# EAGLE design untitled (EAGLE 6.5.0)
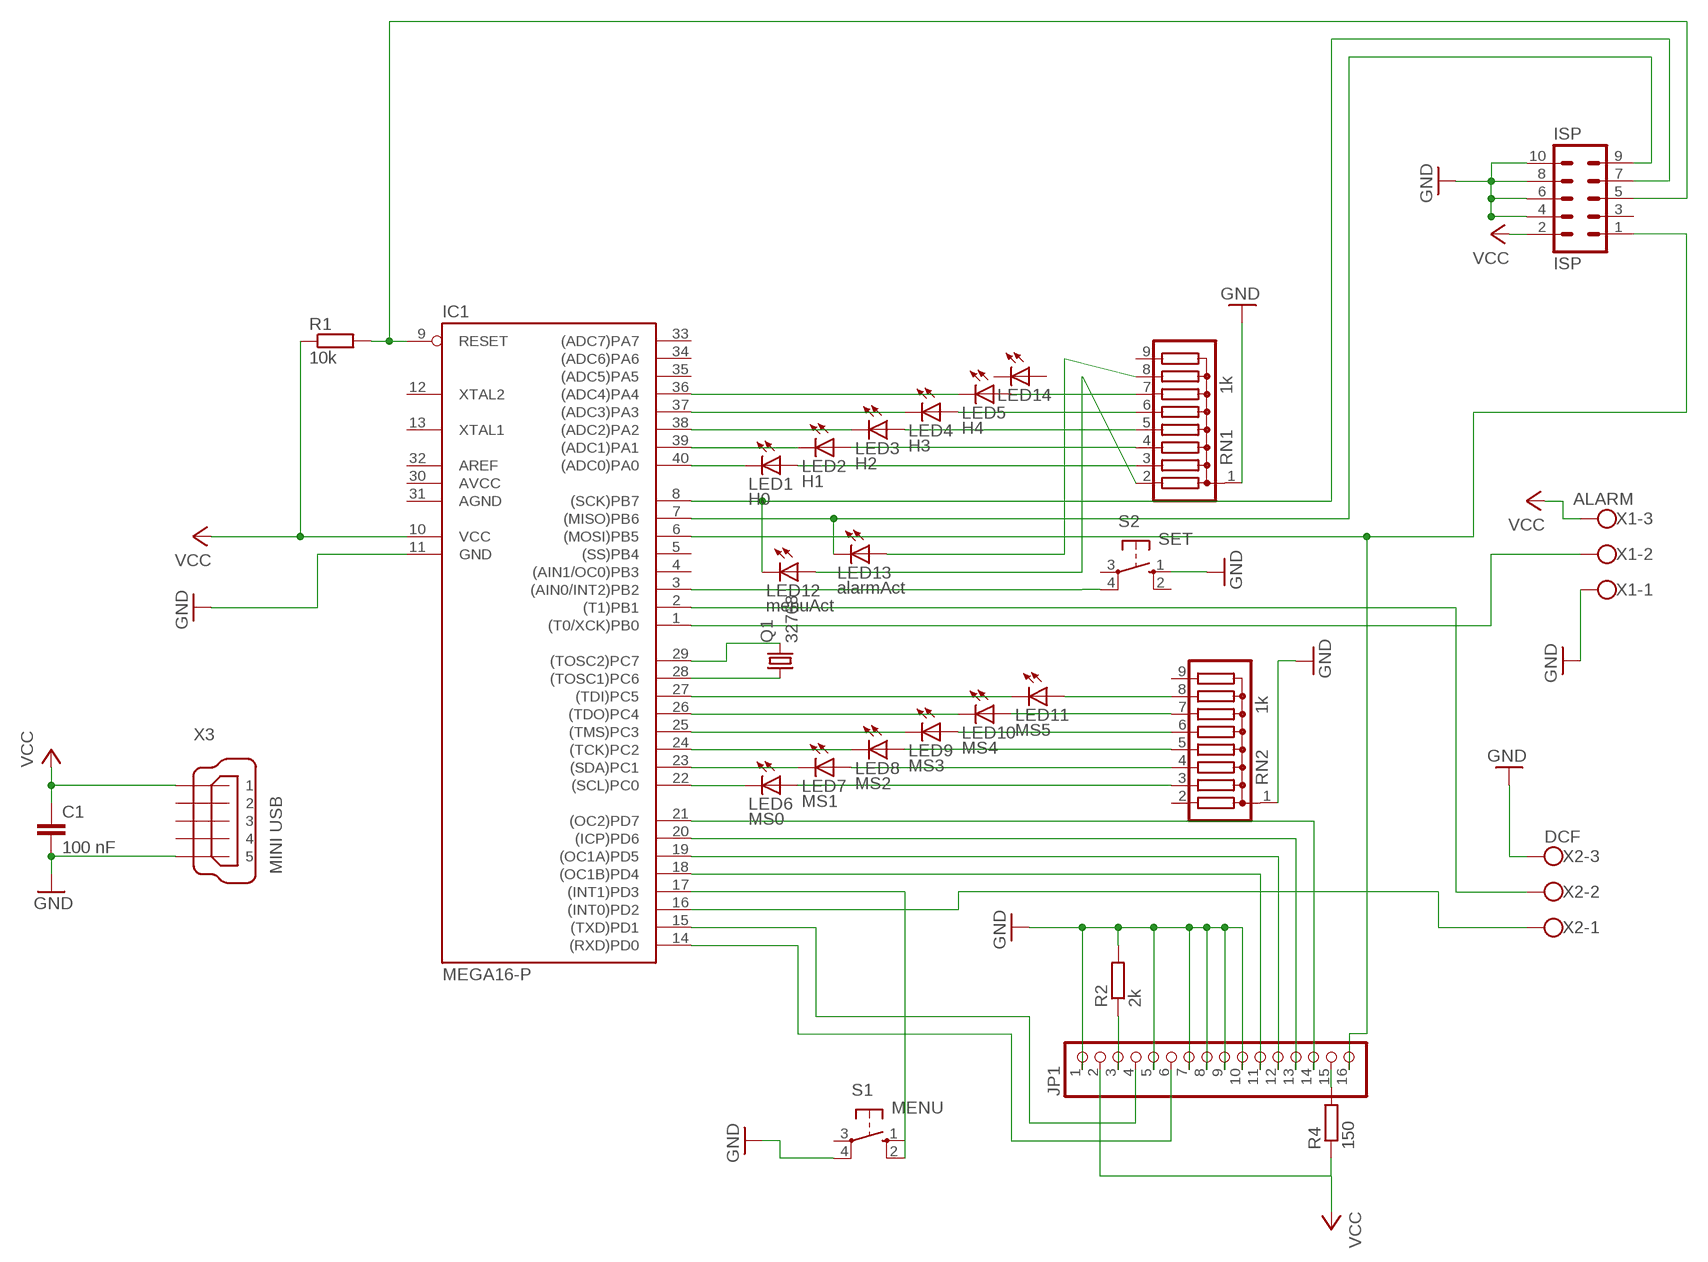
[diagram p0: schematic, sheet 1]

## Parts
C1  100 nF  C-EU050-025X075  [C050-025X075]
IC1  MEGA16-P  [DIL40]
ISP  ISP  ML10  [ML10]
JP1  PINHD-1X16  [1X16]
LED1  H0  LED3MM  [LED3MM]
LED2  H1  LED3MM  [LED3MM]
LED3  H2  LED3MM  [LED3MM]
LED4  H3  LED3MM  [LED3MM]
LED5  H4  LED3MM  [LED3MM]
LED6  MS0  LED3MM  [LED3MM]
LED7  MS1  LED3MM  [LED3MM]
LED8  MS2  LED3MM  [LED3MM]
LED9  MS3  LED3MM  [LED3MM]
LED10  MS4  LED3MM  [LED3MM]
LED11  MS5  LED3MM  [LED3MM]
LED12  menuAct  LED3MM  [LED3MM]
LED13  alarmAct  LED3MM  [LED3MM]
LED14  LED3MM  [LED3MM]
Q1  32768  CRYSTALTC26V  [TC26V]
R1  10k  R-EU_0207/10  [0207/10]
R2  2k  R-EU_0207/10  [0207/10]
R4  150  R-EU_0204/7  [0204/7]
RN1  1k  G08R  [SIL9]
RN2  1k  G08R  [SIL9]
S1  MENU  10-XX  [B3F-10XX]
S2  SET  10-XX  [B3F-10XX]
X1  ALARM  W237-03P  [W237-133]
X2  DCF  W237-03P  [W237-133]
X3  MINI USB  MINI-USB_SHIELD5P2-32005-601  [32005-601]

## Nets
GND: C1.2 IC1.11(GND) ISP.4 ISP.6 ISP.8 ISP.10 JP1.1 JP1.5 JP1.7 JP1.8 JP1.9 JP1.10 R2.2 RN1.1 RN2.1 S1.4(P1) S2.1(S) X1.1 X2.3 X3.5
N$1: IC1.40((ADC0)PA0) LED1.K(C)
N$2: IC1.39((ADC1)PA1) LED2.K(C)
N$3: IC1.38((ADC2)PA2) LED3.K(C)
N$4: IC1.37((ADC3)PA3) LED4.K(C)
N$5: IC1.36((ADC4)PA4) LED5.K(C)
N$6: IC1.22((SCL)PC0) LED6.K(C)
N$7: IC1.23((SDA)PC1) LED7.K(C)
N$8: IC1.24((TCK)PC2) LED8.K(C)
N$9: IC1.25((TMS)PC3) LED9.K(C)
N$10: IC1.26((TDO)PC4) LED10.K(C)
N$11: IC1.27((TDI)PC5) LED11.K(C)
N$12: IC1.21((OC2)PD7) JP1.14
N$13: LED11.A RN2.8
N$14: LED10.A RN2.7
N$15: LED9.A RN2.6
N$16: LED8.A RN2.5
N$17: LED7.A RN2.4
N$18: IC1.29((TOSC2)PC7) Q1.2
N$19: IC1.28((TOSC1)PC6) Q1.1
N$20: LED1.A RN1.3
N$21: LED2.A RN1.4
N$22: LED3.A RN1.5
N$23: LED4.A RN1.6
N$24: LED5.A RN1.7
N$25: IC1.9(RESET) ISP.5 R1.2
N$26: IC1.1((T0/XCK)PB0) X1.2
N$27: IC1.6((MOSI)PB5) ISP.1 JP1.16
N$28: IC1.8((SCK)PB7) ISP.7 LED12.K(C)
N$29: LED6.A RN2.3
N$30: IC1.20((ICP)PD6) JP1.13
N$31: IC1.19((OC1A)PD5) JP1.12
N$32: IC1.18((OC1B)PD4) JP1.11
N$33: JP1.3 R2.1
N$34: IC1.15((TXD)PD1) JP1.4
N$36: IC1.17((INT1)PD3) S1.2(S1)
N$37: IC1.14((RXD)PD0) JP1.6
N$38: IC1.7((MISO)PB6) ISP.9 LED13.K(C)
N$39: IC1.16((INT0)PD2) X2.1
N$40: IC1.2((T1)PB1) X2.2
N$43: LED12.A RN1.2
N$44: LED13.A RN1.8
N$45: IC1.3((AIN0/INT2)PB2) S2.4(P1)
N$46: JP1.15 R4.2
VCC: C1.1 IC1.10(VCC) ISP.2 JP1.2 R1.1 R4.1 X1.3 X3.1
Unconnected: IC1.4((AIN1/OC0)PB3) IC1.5((SS)PB4) IC1.12(XTAL2) IC1.13(XTAL1) IC1.32(AREF) IC1.33((ADC7)PA7) IC1.34((ADC6)PA6) IC1.35((ADC5)PA5) ISP.3 LED14.A LED14.K(C) RN1.9 RN2.2 RN2.9 S1.1(S) S1.3(P) S2.2(S1) S2.3(P) X3.2 X3.3 X3.4 X3.M1(S1) X3.M2(S2)

## Power pins joined to a net without a drawn wire
AGND: IC1.31(AGND)
AVCC: IC1.30(AVCC)

## Library data of the parts
C1 = resistor:C-EU: CAPACITOR, European symbol
IC1 = atmel:MEGA16-P: MICROCONTROLLER 16 Kbytes FLASH 1 kbytes SRAM 512 bytes EEPROM USART 8-channel 10 bit ADC Source: avr.lbr
ISP = con-ml:ML10: HARTING
JP1 = pinhead:PINHD-1X16: PIN HEADER
LED1-LED14 = led:LED: LED OSRAM: - CHIPLED LG R971, LG N971, LY N971, LG Q971, LY Q971, LO R971, LY R971 LH N974, LH R974 LS Q976, LO Q976, LY Q976 LO Q996 - Hyper CHIPLED LW Q18S LB Q993, LB Q99A, LB R99A - SideLED LS A670, LO A670, LY A670, LG A670, LP A670 LB A673, LV A673, LT A673, LW A673 LH A674 LY A675 LS A676, LA A676, LO A676, LY A676, LW A676 LS A679, LY A679, LG A679 - Hyper Micro SIDELED® LS Y876, LA Y876, LO Y876, LY Y876 LT Y87S - SmartLED LW L88C, LW L88S LB L89C, LB L89S, LG L890 LS L89K, LO L89K, LY L89K LS L896, LA L896, LO L896, LY L896 - TOPLED LS T670, LO T670, LY T670, LG T670, LP T670 LSG T670, LSP T670, LSY T670, LOP T670, LYG T670 LG T671, LOG T671, LSG T671 LB T673, LV T673, LT T673, LW T673 LH T674 LS T676, LA T676, LO T676, LY T676, LB T676, LH T676, LSB T676, LW T676 LB T67C, LV T67C, LT T67C, LS T67K, LO T67K, LY T67K, LW E67C LS E67B, LA E67B, LO E67B, LY E67B, LB E67C, LV E67C, LT E67C LW T67C LS T679, LY T679, LG T679 LS T770, LO T770, LY T770, LG T770, LP T770 LB T773, LV T773, LT T773, LW T773 LH T774 LS E675, LA E675, LY E675, LS T675 LS T776, LA T776, LO T776, LY T776, LB T776 LHGB T686 LT T68C, LB T68C - Hyper Mini TOPLED® LB M676 - Mini TOPLED Santana® LG M470 LS M47K, LO M47K, LY M47K Source: http://www.osram.convergy.de - LUMILED® LXK2-PW12-R00, LXK2-PW12-S00, LXK2-PW14-U00, LXK2-PW14-V00 LXK2-PM12-R00, LXK2-PM12-S00, LXK2-PM14-U00 LXK2-PE12-Q00, LXK2-PE12-R00, LXK2-PE12-S00, LXK2-PE14-T00, LXK2-PE14-U00 LXK2-PB12-K00, LXK2-PB12-L00, LXK2-PB12-M00, LXK2-PB14-N00, LXK2-PB14-P00, LXK2-PB14-Q00 LXK2-PR12-L00, LXK2-PR12-M00, LXK2-PR14-Q00, LXK2-PR14-R00 LXK2-PD12-Q00, LXK2-PD12-R00, LXK2-PD12-S00 LXK2-PH12-R00, LXK2-PH12-S00 LXK2-PL12-P00, LXK2-PL12-Q00, LXK2-PL12-R00 Source: www.luxeon.com
Q1 = crystal:CRYSTAL: CRYSTAL
R1 R2 R4 = resistor:R-EU_: RESISTOR, European symbol
RN1 RN2 = resistor-sil:G08R: SIL RESISTOR
S1 S2 = switch-omron:10-XX: OMRON SWITCH
X1 X2 = con-wago-508:W237-03P: WAGO SREW CLAMP
X3 = con-cypressindustries:MINI-USB_SHIELD5P2-: MINI USB-B R/A DIP 5pol. Source: www.cypressindustries.com

## Board
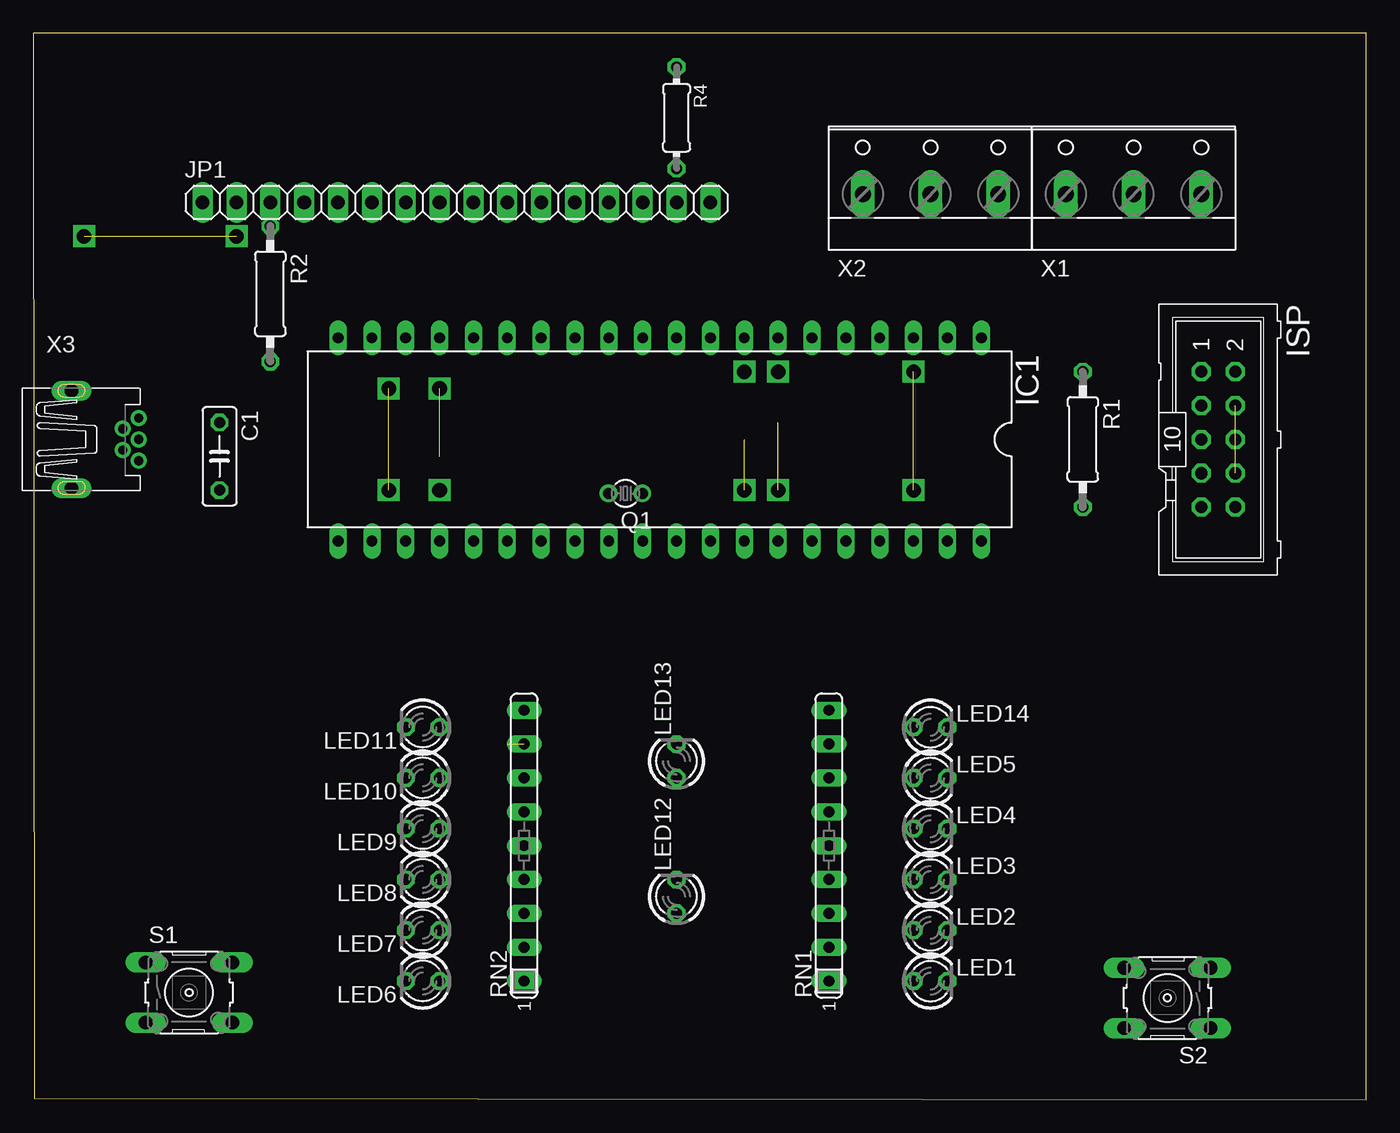
[diagram p1: board, top side]
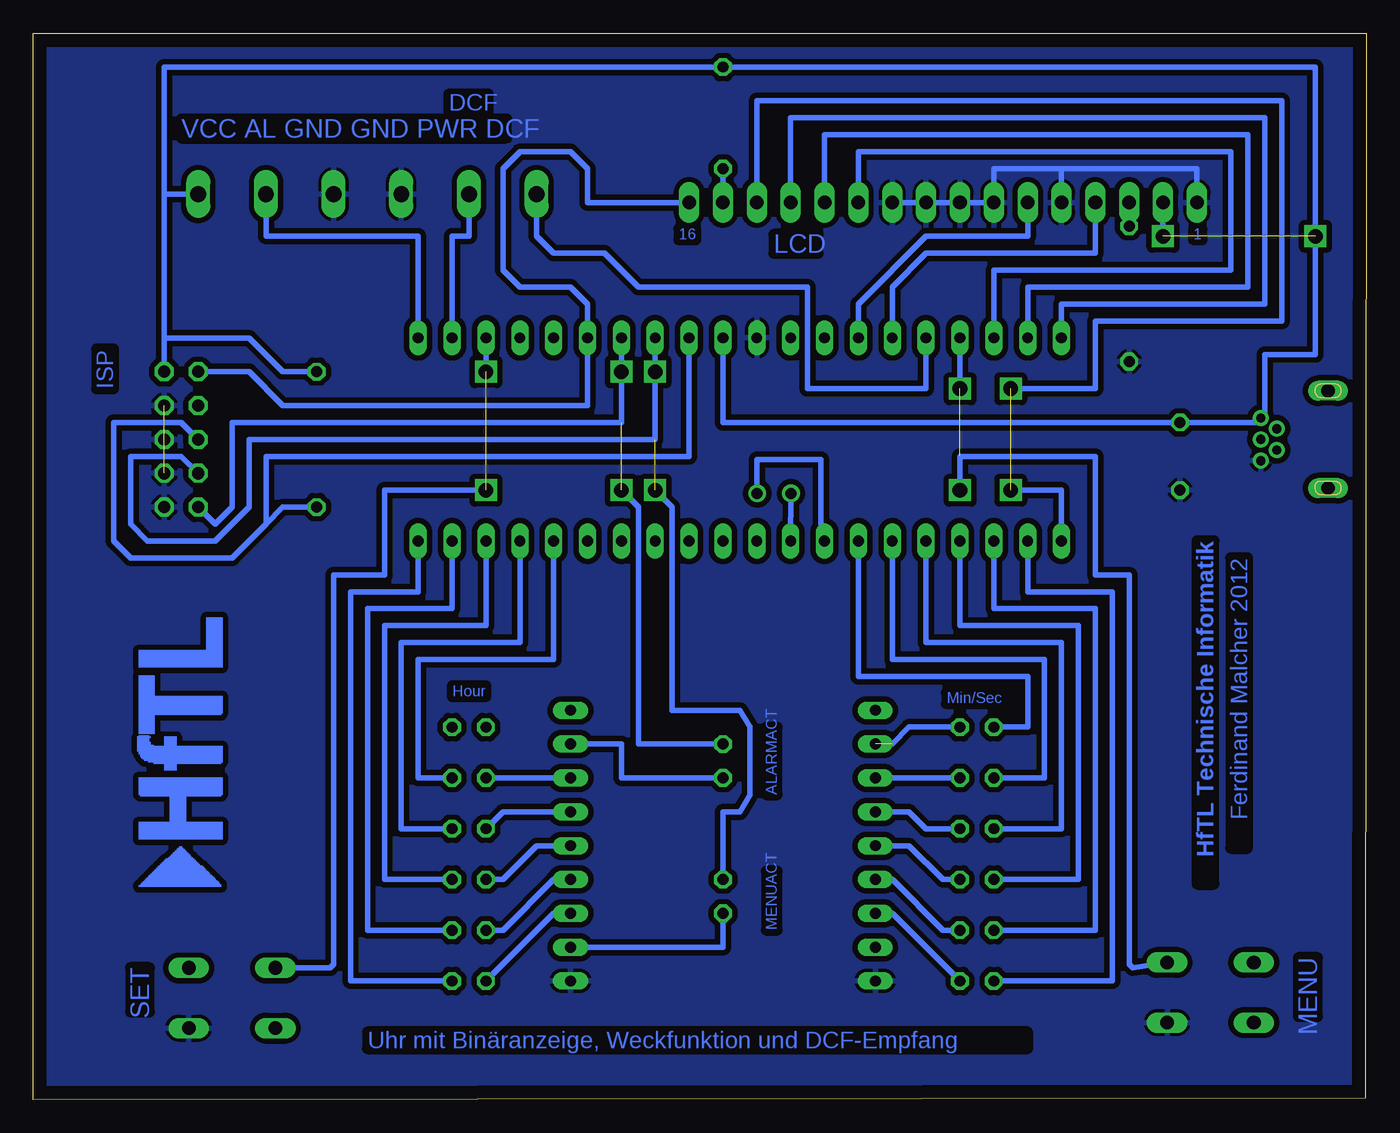
[diagram p2: board, bottom side, seen from below]

Size 100 x 80 mm. Coordinates in mm from the lower left corner, seen from the top.
Outline: 0.05,0.1 100,0 100,80 0,80 0.05,0.1
Copper layers (1*16): Top 0.035mm / dielectric 1.5mm / Bottom 0.035mm
Design rules "default": minimum track width 10mil, minimum drill 24mil, track to track 8mil, track to pad 8mil, pad to pad 8mil, via to via 8mil, smd to smd 8mil, copper to edge 40mil, drill to drill 8mil, minimum pad ring 10mil, minimum via ring 8mil, stop-mask expansion 4mil, vias tented up to drill 0mil, thermal gap 10mil

### Footprints (pad centres in the part's own frame; a part is rotated, then mirrored left to right if it is on the bottom)
C050-025X075 = drill 0.813 octagon: 1 -2.54,0; 2 2.54,0
DIL40 = drill 0.813 long: 1 -24.13,-7.62; 2 -21.59,-7.62; 3 -19.05,-7.62; 4 -16.51,-7.62; 5 -13.97,-7.62; 6 -11.43,-7.62; 7 -8.89,-7.62; 8 -6.35,-7.62; 9 -3.81,-7.62; 10 -1.27,-7.62; 11 1.27,-7.62; 12 3.81,-7.62; 13 6.35,-7.62; 14 8.89,-7.62; 15 11.43,-7.62; 16 13.97,-7.62; 17 16.51,-7.62; 18 19.05,-7.62; 19 21.59,-7.62; 20 24.13,-7.62; 21 24.13,7.62; 22 21.59,7.62; 23 19.05,7.62; 24 16.51,7.62; 25 13.97,7.62; 26 11.43,7.62; 27 8.89,7.62; 28 6.35,7.62; 29 3.81,7.62; 30 1.27,7.62; 31 -1.27,7.62; 32 -3.81,7.62; 33 -6.35,7.62; 34 -8.89,7.62; 35 -11.43,7.62; 36 -13.97,7.62; 37 -16.51,7.62; 38 -19.05,7.62; 39 -21.59,7.62; 40 -24.13,7.62
ML10 = drill 0.914 octagon: 1 -5.08,-1.27; 2 -5.08,1.27; 3 -2.54,-1.27; 4 -2.54,1.27; 5 0,-1.27; 6 0,1.27; 7 2.54,-1.27; 8 2.54,1.27; 9 5.08,-1.27; 10 5.08,1.27
1X16 = drill 1.016 long: 1 -19.05,0; 2 -16.51,0; 3 -13.97,0; 4 -11.43,0; 5 -8.89,0; 6 -6.35,0; 7 -3.81,0; 8 -1.27,0; 9 1.27,0; 10 3.81,0; 11 6.35,0; 12 8.89,0; 13 11.43,0; 14 13.97,0; 15 16.51,0; 16 19.05,0
LED3MM = drill 0.813 octagon: A -1.27,0; K 1.27,0
TC26V = drill 0.813: 1 -1.27,0; 2 1.27,0
0207/10 = drill 0.813 octagon: 1 -5.08,0; 2 5.08,0
0204/7 = drill 0.813 octagon: 1 -3.81,0; 2 3.81,0
SIL9 = drill 0.813 long: 1 -10.16,0; 2 -7.62,0; 3 -5.08,0; 4 -2.54,0; 5 0,0; 6 2.54,0; 7 5.08,0; 8 7.62,0; 9 10.16,0
B3F-10XX = drill 1.016 long: 1 -3.251,2.261; 2 3.251,2.261; 3 -3.251,-2.261; 4 3.251,-2.261
W237-133 = drill 1.194 long: 1 -5.08,-0.635; 2 0,-0.635; 3 5.08,-0.635
32005-601 = drill 0.7 pad 1.016: 1 2.825,1.6; 2 1.625,0.8; 3 2.825,0; 4 1.625,-0.8; 5 2.825,-1.6 | drill 1 pad 1.422 long: M1 -2.225,3.65; M2 -2.225,-3.65

### Placement (x,y rotation side)
C1  13.97,48.26 270 top
IC1  46.99,49.53 180 top
ISP  88.9,49.53 270 top
JP1  31.75,67.31 0 top
LED1  67.31,8.89 0 top
LED2  67.31,12.7 0 top
LED3  67.31,16.51 0 top
LED4  67.31,20.32 0 top
LED5  67.31,24.13 0 top
LED6  29.21,8.89 180 top
LED7  29.21,12.7 180 top
LED8  29.21,16.51 180 top
LED9  29.21,20.32 180 top
LED10  29.21,24.13 180 top
LED11  29.21,27.94 180 top
LED12  48.26,15.24 90 top
LED13  48.26,25.4 90 top
LED14  67.31,27.94 0 top
Q1  44.43,45.48 180 top
R1  78.74,49.53 270 top
R2  17.78,60.45 270 top
R4  48.26,73.66 270 top
RN1  59.69,19.05 90 top
RN2  36.83,19.05 90 top
S1  11.68,8.03 0 top
S2  85.09,7.62 180 top
X1  82.55,68.58 0 top
X2  67.31,68.58 0 top
X3  5.08,49.53 0 top

### Tracks (layer width: path | path; a pad name or v marks a point on that pad's centre or on a via)
GND  (2 unrouted)
  Bottom 0.406: JP1.1 12.7,69.85 22.86,69.85 | JP1.5 22.86,69.85 | 22.86,69.85 27.94,69.85 JP1.7 JP1.8 JP1.9 JP1.10
  pour Bottom (isolate 0.406): -2.54,81.28 101.6,81.28 101.6,0 -2.54,0
N$1
  Bottom 0.406: IC1.40 71.12,38.1 76.2,38.1 76.2,8.89 LED1.K
N$2
  Bottom 0.406: IC1.39 68.58,36.83 74.93,36.83 74.93,12.7 LED2.K
N$3
  Bottom 0.406: IC1.38 66.04,35.56 73.66,35.56 73.66,16.51 LED3.K
N$4
  Bottom 0.406: IC1.37 63.5,34.29 72.39,34.29 72.39,20.32 LED4.K
N$5
  Bottom 0.406: IC1.36 60.96,33.02 71.12,33.02 71.12,24.13 LED5.K
N$6
  Bottom 0.406: IC1.22 25.4,38.1 19.05,38.1 19.05,8.89 LED6.K
N$7
  Bottom 0.406: IC1.23 27.94,36.83 20.32,36.83 20.32,12.7 LED7.K
N$8
  Bottom 0.406: IC1.24 30.48,35.56 21.59,35.56 21.59,16.51 LED8.K
N$9
  Bottom 0.406: IC1.25 33.02,34.29 22.86,34.29 22.86,20.32 LED9.K
N$10
  Bottom 0.406: IC1.26 35.56,33.02 24.13,33.02 24.13,24.13 LED10.K
N$11
  Bottom 0.406: IC1.27 38.1,31.75 25.4,31.75 25.4,27.94 LED11.K
N$12  (1 unrouted)
  Bottom 0.406: JP1.14 45.72,74.93 6.35,74.93 6.35,58.42 20.32,58.42 20.32,53.34 26.67,53.34 | IC1.21 22.86,45.72 26.67,45.72
N$13  (1 unrouted)
  Bottom 0.406: LED11.A 34.29,27.94 35.56,26.67
N$14
  Bottom 0.406: LED10.A RN2.7
N$15
  Bottom 0.406: LED9.A 33.02,20.32 34.29,21.59 RN2.6
N$16
  Bottom 0.406: RN2.5 34.29,19.05 31.75,16.51 LED8.A
N$17
  Bottom 0.406: LED7.A 31.75,12.7 35.56,16.51 RN2.4
N$18
  Bottom 0.406: Q1.2 IC1.29
N$19
  Bottom 0.406: IC1.28 40.89,41.91 40.89,48.01 45.7,48.01 Q1.1
N$20
  Bottom 0.406: RN1.3 60.96,13.97 LED1.A
N$21
  Bottom 0.406: RN1.4 60.96,16.51 64.77,12.7 LED2.A
N$22
  Bottom 0.406: RN1.5 62.23,19.05 64.77,16.51 LED3.A
N$23
  Bottom 0.406: RN1.6 64.77,21.59 LED4.A
N$24
  Bottom 0.406: RN1.7 LED5.A
N$25
  Bottom 0.406: IC1.9 50.8,48.26 82.55,48.26 82.55,43.18 | 82.55,43.18 85.09,40.64 92.71,40.64 93.98,41.91 93.98,50.8 88.9,50.8 ISP.5 | R1.2 81.28,44.45 82.55,43.18
N$26
  Bottom 0.406: IC1.1 71.12,64.77 82.55,64.77 X1.2
N$27
  Bottom 0.406: ISP.1 83.82,54.61 81.28,52.07 58.42,52.07 IC1.6 58.42,59.69 59.69,60.96 63.5,60.96 64.77,62.23 64.77,69.85 63.5,71.12 59.69,71.12 58.42,69.85 58.42,67.31 JP1.16
N$28  (1 unrouted)
  Bottom 0.406: IC1.8 53.34,49.53 83.82,49.53 83.82,44.45 86.36,41.91 91.44,41.91 92.71,43.18 92.71,48.26 88.9,48.26 ISP.7 | LED12.K 48.26,21.59 46.99,21.59 46.23,22.86 46.23,27.94 46.99,29.21 52.07,29.21 52.07,44.45 53.34,45.72
N$29
  Bottom 0.406: LED6.A 35.56,13.97 RN2.3
N$30
  Bottom 0.406: JP1.13 43.18,73.66 7.62,73.66 7.62,59.69 22.86,59.69 IC1.20
N$31
  Bottom 0.406: JP1.12 40.64,72.39 8.89,72.39 8.89,60.96 25.4,60.96 IC1.19
N$32
  Bottom 0.406: JP1.11 38.1,71.12 10.16,71.12 10.16,62.23 27.94,62.23 IC1.18
N$33
  Bottom 0.406: R2.1 JP1.3
N$34
  Bottom 0.406: IC1.15 35.56,60.96 33.02,63.5 20.32,63.5 JP1.4
N$35  (via drill 1.1)
  other vias: 66.04,54.61
N$36  (1 unrouted)
  Bottom 0.406: IC1.17 30.48,53.34 | S1.2 17.5,9.88 17.78,10.16 17.78,39.37 20.32,39.37 20.32,48.26 30.48,48.26 30.48,45.72
N$37
  Bottom 0.406: IC1.14 38.1,59.69 33.02,64.77 25.4,64.77 JP1.6
N$38  (via drill 1.1)  (1 unrouted)
  Bottom 0.406: LED13.K 54.61,26.67 54.61,44.45 v55.88,45.72 | IC1.7 v55.88,54.61 55.88,50.8 85.09,50.8 85.09,44.45 86.36,43.18 ISP.9
N$39
  Bottom 0.406: IC1.16 33.02,53.34 41.91,53.34 41.91,60.96 54.61,60.96 57.15,63.5 60.96,63.5 62.23,64.77 X2.1
N$40
  Bottom 0.406: IC1.2 68.58,64.77 67.31,64.77 X2.2
N$41  (via drill 1.1)
  other vias: 66.04,45.72
N$42  (via drill 1.1)
  other vias: 30.48,53.34
N$43
  Bottom 0.406: LED12.A 48.26,11.43 RN1.2
N$44
  Bottom 0.406: LED13.A 55.88,24.13 55.88,26.67 RN1.8
N$45  (1 unrouted)
  Bottom 0.406: IC1.3 66.04,54.61 | S2.4 77.75,9.88 77.47,10.16 77.47,39.37 73.66,39.37 73.66,45.72 66.04,45.72
N$46
  Bottom 0.406: R4.2 JP1.15
N$47  (via drill 1.1)
  other vias: 30.48,45.72
N$48  (via drill 1.1)
  other vias: 53.34,54.61
N$49  (via drill 1.1)
  other vias: 26.67,53.34
N$50  (via drill 1.1)
  other vias: 26.67,45.72
N$51  (via drill 1.1)
  other vias: 53.34,45.72
N$52  (via drill 1.1)
  other vias: 15.24,64.77
VCC  (via drill 1.1)  (1 unrouted)
  Bottom 0.406: IC1.10 48.26,50.8 C1.1 8.23,50.8 X3.1 7.62,51.13 7.62,55.88 3.81,55.88 v3.81,64.77 3.81,77.47 R4.1 90.17,77.47 90.17,67.94 | 90.17,67.94 90.17,57.15 | 90.17,57.15 ISP.2 | JP1.2 15.24,64.77 | X1.3 90.17,67.94 | R1.1 81.28,54.61 83.82,57.15 90.17,57.15
(copper drawn outside any net)
  shapes: Bottom area x361

### Text on the board
Bottom: DCF | VCC AL GND GND PWR DCF | 1 | 16 | LCD | ISP | HfTL Technische Informatik | Ferdinand Malcher 2012 | Min/Sec | Hour | ALARMACT | MENUACT | MENU | SET | Uhr mit Binäranzeige, Weckfunktion und DCF-Empfang